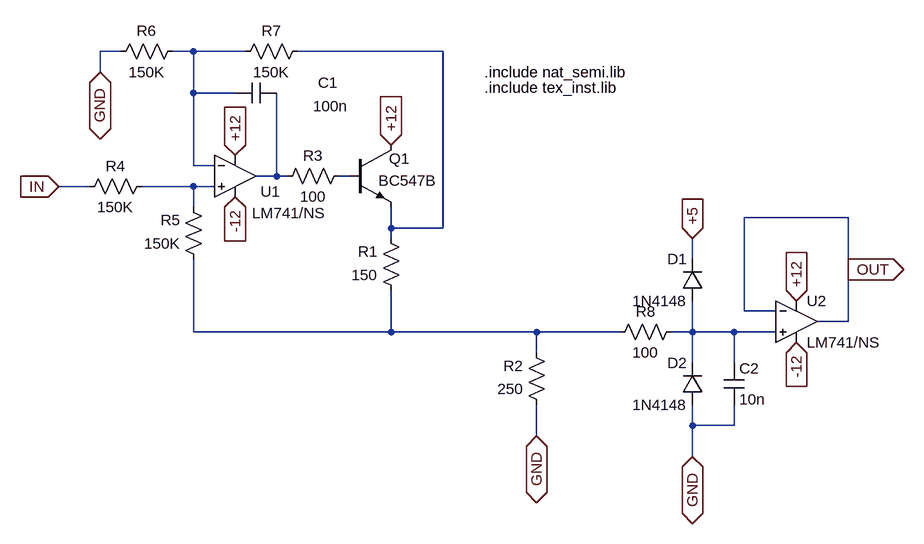
[diagram p0: schematic Component_2.asc]
Component_2.asc, the LTspice schematic file:
Version 4.1
SHEET 1 936 688
WIRE -272 -48 -304 -48
WIRE -160 -48 -192 -48
WIRE -80 -48 -160 -48
WIRE 224 -48 0 -48
WIRE -304 -16 -304 -48
WIRE -160 16 -160 -48
WIRE -96 16 -160 16
WIRE -160 128 -160 16
WIRE -128 128 -160 128
WIRE -32 144 -32 16
WIRE -32 144 -64 144
WIRE -16 144 -32 144
WIRE 80 144 64 144
WIRE -320 160 -368 160
WIRE -160 160 -240 160
WIRE -128 160 -160 160
WIRE -160 192 -160 160
WIRE 848 208 688 208
WIRE 144 224 144 192
WIRE 224 224 224 -48
WIRE 224 224 144 224
WIRE 144 240 144 224
WIRE 608 272 608 240
WIRE 848 288 848 208
WIRE 688 352 688 208
WIRE 736 352 688 352
WIRE 848 368 848 288
WIRE 848 368 800 368
WIRE -160 384 -160 272
WIRE 144 384 144 320
WIRE 144 384 -160 384
WIRE 368 384 144 384
WIRE 496 384 368 384
WIRE 608 384 608 336
WIRE 608 384 576 384
WIRE 672 384 608 384
WIRE 736 384 672 384
WIRE 368 416 368 384
WIRE 608 432 608 384
WIRE 672 432 672 384
WIRE 608 528 608 496
WIRE 672 528 672 496
WIRE 672 528 608 528
WIRE 368 544 368 496
WIRE 608 576 608 528
FLAG 848 288 OUT
IOPIN 848 288 Out
FLAG -368 160 IN
IOPIN -368 160 In
FLAG -304 -16 GND
IOPIN -304 -16 BiDir
FLAG 368 544 GND
IOPIN 368 544 BiDir
FLAG 608 576 GND
IOPIN 608 576 BiDir
FLAG -96 112 +12
IOPIN -96 112 In
FLAG 768 336 +12
IOPIN 768 336 In
FLAG 144 96 +12
IOPIN 144 96 In
FLAG -96 176 -12
IOPIN -96 176 In
FLAG 768 400 -12
IOPIN 768 400 In
FLAG 608 240 +5
IOPIN 608 240 In
SYMBOL OpAmps\\opamp2 -96 80 R0
WINDOW 0 39 88 Left 2
WINDOW 3 26 121 Left 2
SYMATTR InstName U1
SYMATTR Value LM741/NS
SYMBOL npn 80 96 R0
WINDOW 0 61 21 Left 2
WINDOW 3 45 55 Left 2
SYMATTR InstName Q1
SYMATTR Value BC547B
SYMBOL res 160 336 R180
WINDOW 0 36 76 Left 2
WINDOW 3 36 40 Left 2
SYMATTR InstName R1
SYMATTR Value 150
SYMBOL res 384 512 R180
WINDOW 0 36 76 Left 2
WINDOW 3 36 40 Left 2
SYMATTR InstName R2
SYMATTR Value 250
SYMBOL res 80 128 R90
WINDOW 0 0 56 VBottom 2
WINDOW 3 32 56 VTop 2
SYMATTR InstName R3
SYMATTR Value 100
SYMBOL res -224 144 R90
WINDOW 0 0 56 VBottom 2
WINDOW 3 32 56 VTop 2
SYMATTR InstName R4
SYMATTR Value 150K
SYMBOL res -144 288 R180
WINDOW 0 36 76 Left 2
WINDOW 3 36 40 Left 2
SYMATTR InstName R5
SYMATTR Value 150K
SYMBOL cap -32 0 R90
WINDOW 0 16 -79 VBottom 2
WINDOW 3 21 -83 VTop 2
SYMATTR InstName C1
SYMATTR Value 100n
SYMBOL res -176 -64 R90
WINDOW 0 0 56 VBottom 2
WINDOW 3 32 56 VTop 2
SYMATTR InstName R6
SYMATTR Value 150K
SYMBOL res 16 -64 R90
WINDOW 0 0 56 VBottom 2
WINDOW 3 32 56 VTop 2
SYMATTR InstName R7
SYMATTR Value 150K
SYMBOL res 592 368 R90
WINDOW 0 0 56 VBottom 2
WINDOW 3 32 56 VTop 2
SYMATTR InstName R8
SYMATTR Value 100
SYMBOL diode 624 336 R180
WINDOW 0 24 64 Left 2
WINDOW 3 24 0 Left 2
SYMATTR InstName D1
SYMATTR Value 1N4148
SYMBOL diode 624 496 R180
WINDOW 0 24 64 Left 2
WINDOW 3 24 0 Left 2
SYMATTR InstName D2
SYMATTR Value 1N4148
SYMBOL cap 656 432 R0
SYMATTR InstName C2
SYMATTR Value 10n
SYMBOL Opamps\\opamp2 768 304 R0
SYMATTR InstName U2
SYMATTR Value LM741/NS
TEXT 288 -16 Left 2 !.include nat_semi.lib
TEXT 288 8 Left 2 !.include tex_inst.lib

The netlist it stands for:
* Component_2.asc
X§U1 N005 N001 +12 -12 N003 LM741/NS  ; pins In+ In- V+ V- OUT
Q1 +12 N004 N002 0 BC547B
R1 N006 N002 150
R2 GND N006 250
R3 N004 N003 100
R4 N005 IN 150K
R5 N006 N005 150K
C1 N003 N001 100n
R6 N001 GND 150K
R7 N002 N001 150K
R8 N007 N006 100
D1 N007 +5 1N4148
D2 GND N007 1N4148
C2 N007 GND 10n
X§U2 N007 OUT +12 -12 OUT LM741/NS  ; pins In+ In- V+ V- OUT
.model D D
.lib standard.dio
.model NPN NPN
.model PNP PNP
.lib standard.bjt
.include nat_semi.lib
.include tex_inst.lib
.backanno
.end